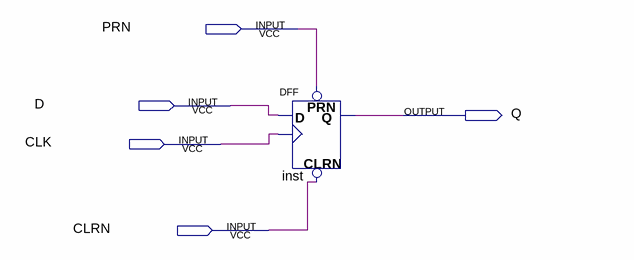
[diagram p0: schematic sheet]
// Quartus schematic dfftest.bdf as structural Verilog: 1 symbols, 5 pins
module dfftest (
  input  PRN,
  input  D,
  input  CLK,
  input  CLRN,
  output Q
);

  DFF inst (.CLRN(CLRN), .CLK(CLK), .D(D), .PRN(PRN), .Q(Q));
endmodule
